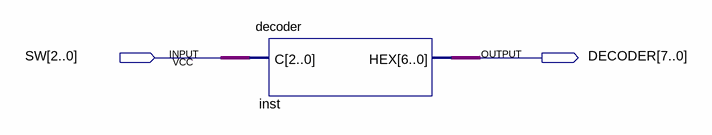
[diagram p0: schematic sheet]
// Quartus schematic PART4.bdf as structural Verilog: 1 symbols, 2 pins
module PART4 (
  input  [2:0] SW,
  output [7:0] DECODER
);

  decoder inst (.C(SW), .HEX(DECODER));
endmodule
